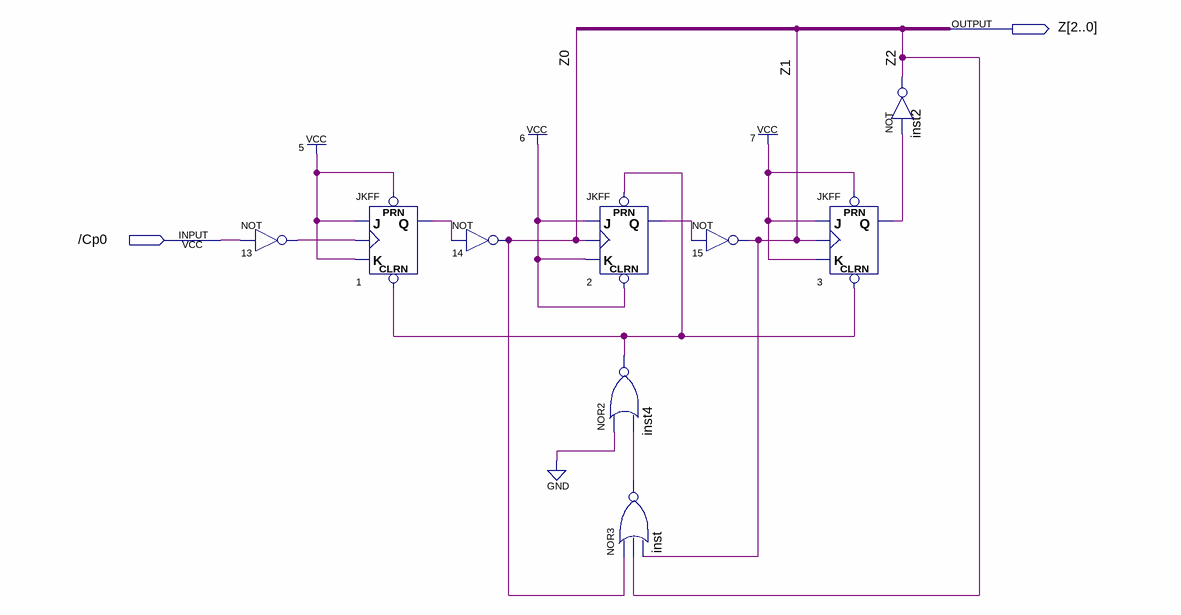
[diagram p0: schematic sheet]
// Quartus schematic fig12-9.bdf as structural Verilog: 9 symbols, 2 pins
module \fig12-9  (
  input  \/Cp0 ,
  output [2:0] Z
);

  wire inst4_out, inst_out, n1_q, n2_q, n3_q, n13_out;

  not u_13 (n13_out, \/Cp0 );
  JKFF u_1 (.PRN(1'b1), .CLRN(inst4_out), .K(1'b1), .J(1'b1), .CLK(n13_out), .Q(n1_q));
  not u_14 (Z[0], n1_q);
  JKFF u_2 (.PRN(inst4_out), .CLRN(1'b1), .K(1'b1), .J(1'b1), .CLK(Z[0]), .Q(n2_q));
  nor inst4 (inst4_out, 1'b0, inst_out);
  nor inst (inst_out, Z[0], Z[2], Z[1]);
  not u_15 (Z[1], n2_q);
  JKFF u_3 (.PRN(1'b1), .CLRN(inst4_out), .K(1'b1), .J(1'b1), .CLK(Z[1]), .Q(n3_q));
  not inst2 (Z[2], n3_q);
endmodule
